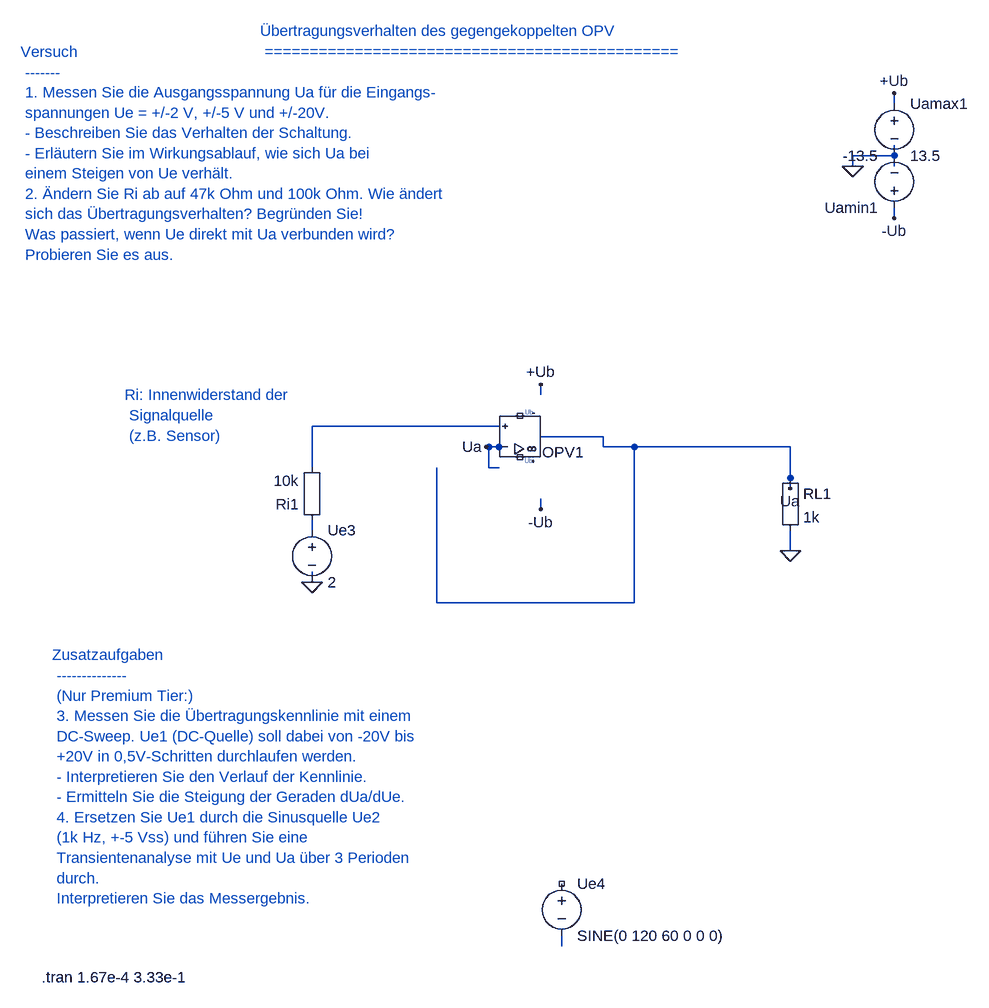
[diagram p0: schematic 1_2_1_Impedanzwandler.asc]
1_2_1_Impedanzwandler.asc, the LTspice schematic file:
Version 4
SHEET 1 880 680
WIRE 768 688 752 688
WIRE 752 688 752 720
WIRE 752 720 768 720
WIRE 832 672 928 672
WIRE 928 672 928 688
WIRE 1376 240 1376 224
WIRE 1376 240 1376 256
WIRE 480 896 480 880
WIRE 864 1440 864 1456
WIRE 1376 160 1376 144
WIRE 832 592 832 608
WIRE 832 784 832 768
WIRE 1216 736 1216 688
WIRE 1216 688 976 688
WIRE 976 688 928 688
WIRE 672 720 672 928
WIRE 672 928 976 928
WIRE 976 928 976 688
WIRE 1376 240 1312 240
WIRE 1312 240 1312 256
WIRE 1376 320 1376 336
WIRE 1216 848 1216 816
WIRE 480 816 480 800
WIRE 480 720 480 656
WIRE 480 656 768 656
WIRE 1216 736 1216 752
WIRE 768 688 748 688
FLAG 480 896 0
FLAG 1312 256 0
FLAG 1216 848 0
FLAG 1312 256 0
FLAG 480 896 0
FLAG 1216 848 0
FLAG 1376 144 +Ub
FLAG 832 592 +Ub
FLAG 1376 336 -Ub
FLAG 832 784 -Ub
FLAG 1216 752 Ua
FLAG 748 688 Ua
SYMBOL UniversalOpAmp2 800 672 M180
SYMATTR InstName OPV1
SYMATTR Value UniversalOpAmp2
SYMBOL voltage 1376 144 R0
SYMATTR InstName Uamax1
SYMATTR Value 13.5
SYMBOL voltage 1376 336 R180
SYMATTR InstName Uamin1
SYMATTR Value -13.5
SYMBOL voltage 480 800 R0
SYMATTR InstName Ue3
SYMATTR Value 2
SYMBOL voltage 864 1344 R0
SYMATTR InstName Ue4
SYMATTR Value SINE(0 120 60 0 0 0)
SYMBOL Misc\EuropeanResistor 496 816 R180
SYMATTR InstName Ri1
SYMATTR Value 10k
SYMBOL Misc\EuropeanResistor 1200 720 R0
SYMATTR InstName RL1
SYMATTR Value 1k
TEXT 64 1504 Left 2 !.tran 1.67e-4 3.33e-1
TEXT 400 48 Left 2 ;Übertragungsverhalten des gegengekoppelten OPV \n ==============================================
TEXT 32 80 Left 2 ;Versuch \n ------- \n 1. Messen Sie die Ausgangsspannung Ua für die Eingangs- \n spannungen Ue = +/-2 V, +/-5 V und +/-20V. \n - Beschreiben Sie das Verhalten der Schaltung. \n - Erläutern Sie im Wirkungsablauf, wie sich Ua bei \n einem Steigen von Ue verhält. \n 2. Ändern Sie Ri ab auf 47k Ohm und 100k Ohm. Wie ändert \n sich das Übertragungsverhalten? Begründen Sie! \n Was passiert, wenn Ue direkt mit Ua verbunden wird? \n Probieren Sie es aus.
TEXT 80 1008 Left 2 ;Zusatzaufgaben \n -------------- \n (Nur Premium Tier:) \n 3. Messen Sie die Übertragungskennlinie mit einem \n DC-Sweep. Ue1 (DC-Quelle) soll dabei von -20V bis \n +20V in 0,5V-Schritten durchlaufen werden. \n - Interpretieren Sie den Verlauf der Kennlinie. \n - Ermitteln Sie die Steigung der Geraden dUa/dUe. \n 4. Ersetzen Sie Ue1 durch die Sinusquelle Ue2 \n (1k Hz, +-5 Vss) und führen Sie eine \n Transientenanalyse mit Ue und Ua über 3 Perioden \n durch. \n Interpretieren Sie das Messergebnis.
TEXT 192 608 Left 2 ;Ri: Innenwiderstand der \n Signalquelle \n (z.B. Sensor)

The netlist it stands for:
* 1_2_1_Impedanzwandler.asc
XOPV1 N003 Ua NC_01 NC_02 Ua level2 UniversalOpAmp2 Avol=1Meg GBW=10Meg Slew=10Meg Ilimit=25m Rail=0 Vos=0 En=0 Enk=0 In=0 Ink=0 Rin=500Meg  ; pins In+ In- V+ V- OUT
V§Uamax1 +Ub 0 13.5
V§Uamin1 -Ub 0 -13.5
V§Ue3 N002 0 2
V§Ue4 NC_03 N001 SINE(0 120 60 0 0 0)
Ri1 N002 N003 10k
RL1 Ua 0 1k
.tran 1.67e-4 3.33e-1
* Übertragungsverhalten des gegengekoppelten OPV
*  ==============================================
* Versuch
*  -------
*  1. Messen Sie die Ausgangsspannung Ua für die Eingangs-
*  spannungen Ue = +/-2 V, +/-5 V und +/-20V.
*  - Beschreiben Sie das Verhalten der Schaltung.
*  - Erläutern Sie im Wirkungsablauf, wie sich Ua bei
*  einem Steigen von Ue verhält.
*  2. Ändern Sie Ri ab auf 47k Ohm und 100k Ohm. Wie ändert
*  sich das Übertragungsverhalten? Begründen Sie!
*  Was passiert, wenn Ue direkt mit Ua verbunden wird?
*  Probieren Sie es aus.
* Zusatzaufgaben
*  --------------
*  (Nur Premium Tier:)
*  3. Messen Sie die Übertragungskennlinie mit einem
*  DC-Sweep. Ue1 (DC-Quelle) soll dabei von -20V bis
*  +20V in 0,5V-Schritten durchlaufen werden.
*  - Interpretieren Sie den Verlauf der Kennlinie.
*  - Ermitteln Sie die Steigung der Geraden dUa/dUe.
*  4. Ersetzen Sie Ue1 durch die Sinusquelle Ue2
*  (1k Hz, +-5 Vss) und führen Sie eine
*  Transientenanalyse mit Ue und Ua über 3 Perioden
*  durch.
*  Interpretieren Sie das Messergebnis.
* Ri: Innenwiderstand der
*  Signalquelle
*  (z.B. Sensor)
.lib UniversalOpAmp2.lib
.backanno
.end